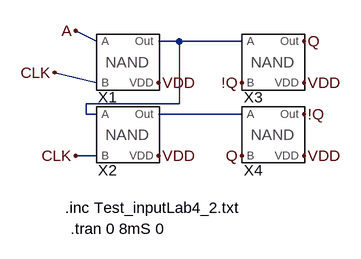
[diagram p0: schematic Lab_4_Latch.asc]
Lab_4_Latch.asc, the LTspice schematic file:
Version 4
SHEET 1 880 680
WIRE 32 48 0 32
WIRE 160 48 128 48
WIRE 256 48 160 48
WIRE 32 112 -32 96
WIRE 160 144 160 48
WIRE 160 144 16 144
WIRE 16 160 16 144
WIRE 32 160 16 160
WIRE 256 160 128 160
WIRE 32 224 0 224
FLAG -32 96 CLK
FLAG 0 224 CLK
FLAG 0 32 A
FLAG 128 112 VDD
FLAG 352 112 VDD
FLAG 352 224 VDD
FLAG 128 224 VDD
FLAG 352 48 Q
FLAG 352 160 !Q
FLAG 256 224 Q
FLAG 256 112 !Q
SYMBOL Gate_NAND 80 80 R0
SYMATTR InstName X1
SYMBOL Gate_NAND 80 192 R0
SYMATTR InstName X2
SYMBOL Gate_NAND 304 80 R0
SYMATTR InstName X3
SYMBOL Gate_NAND 304 192 R0
SYMATTR InstName X4
TEXT -16 304 Left 2 !.inc Test_inputLab4_2.txt
TEXT -8 336 Left 2 !.tran 0 8mS 0

The netlist it stands for:
* Lab_4_Latch.asc
XX1 A CLK N001 VDD Gate_NAND  ; pins A B Out VDD
XX2 N001 CLK N002 VDD Gate_NAND  ; pins A B Out VDD
XX3 N001 !Q Q VDD Gate_NAND  ; pins A B Out VDD
XX4 N002 Q !Q VDD Gate_NAND  ; pins A B Out VDD
.inc Test_inputLab4_2.txt
.tran 0 8mS 0
.backanno
.end